# EAGLE schematic base (EAGLE 7.6.0)
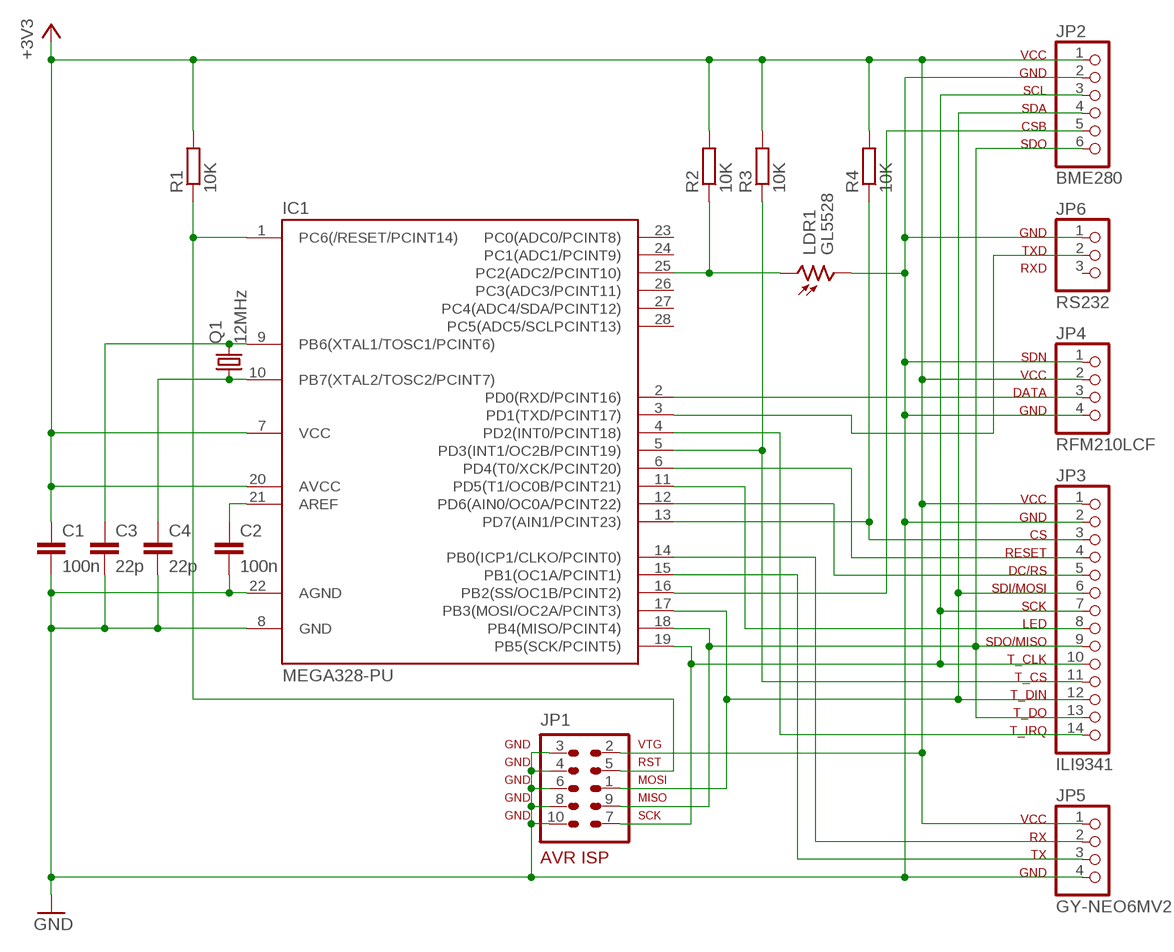
[diagram p0: schematic, sheet 1]

## Parts
C1  100n  C-EU025-025X050  [C025-025X050]
C2  100n  C-EU025-025X050  [C025-025X050]
C3  22p  C-EU025-025X050  [C025-025X050]
C4  22p  C-EU025-025X050  [C025-025X050]
IC1  MEGA328-PU  MEGA48/88/168-PU  [DIL28-3]
JP1  AVR-ISP-10  [AVR-ISP-10]
JP2  BME280  PINHD-1X6  [1X06]
JP3  ILI9341  PINHD-1X14  [1X14]
JP4  RFM210LCF  PINHD-1X4  [1X04]
JP5  GY-NEO6MV2  PINHD-1X4  [1X04]
JP6  RS232  PINHD-1X3  [1X03]
LDR1  GL5528  VT20N1  [TO46-VT200]
Q1  12MHz  CRYSTALHC49U-V  [HC49U-V]
R1  10K  R-EU_0204/7  [0204/7]
R2  10K  R-EU_0204/7  [0204/7]
R3  10K  R-EU_0204/7  [0204/7]
R4  10K  R-EU_0204/7  [0204/7]

## Nets
+3V3: C1.1 IC1.7(VCC) IC1.20(AVCC) JP1.2 JP2.1 JP3.1 JP4.2 JP5.1 R1.2 R2.2 R3.2 R4.2
GND: C1.2 C2.2 C3.2 C4.2 IC1.8(GND) IC1.22(AGND) JP1.3 JP1.4 JP1.6 JP1.8 JP1.10 JP2.2 JP3.2 JP4.1 JP4.4 JP5.4 JP6.1 LDR1.2
N$1: IC1.16(PB2(SS/OC1B/PCINT2)) JP2.5
N$2: IC1.1(PC6(/RESET/PCINT14)) JP1.5 R1.1
N$3: IC1.18(PB4(MISO/PCINT4)) JP1.9 JP2.6 JP3.9 JP3.13
N$4: C2.1 IC1.21(AREF)
N$5: IC1.2(PD0(RXD/PCINT16)) JP4.3
N$6: IC1.12(PD6(AIN0/OC0A/PCINT22)) JP3.5
N$7: IC1.13(PD7(AIN1/PCINT23)) JP3.3 R4.1
N$8: IC1.17(PB3(MOSI/OC2A/PCINT3)) JP1.1 JP2.4 JP3.6 JP3.12
N$9: IC1.4(PD2(INT0/PCINT18)) JP3.14
N$10: IC1.6(PD4(T0/XCK/PCINT20)) JP3.4
N$11: IC1.11(PD5(T1/OC0B/PCINT21)) JP3.8
N$12: IC1.19(PB5(SCK/PCINT5)) JP1.7 JP2.3 JP3.7 JP3.10
N$13: IC1.25(PC2(ADC2/PCINT10)) LDR1.1 R2.1
N$14: IC1.14(PB0(ICP1/CLKO/PCINT0)) JP5.2
N$15: IC1.15(PB1(OC1A/PCINT1)) JP5.3
N$16: IC1.5(PD3(INT1/OC2B/PCINT19)) JP3.11 R3.1
N$17: IC1.3(PD1(TXD/PCINT17)) JP6.2
N$18: C4.1 IC1.10(PB7(XTAL2/TOSC2/PCINT7)) Q1.1
N$19: C3.1 IC1.9(PB6(XTAL1/TOSC1/PCINT6)) Q1.2
Unconnected: IC1.23(PC0(ADC0/PCINT8)) IC1.24(PC1(ADC1/PCINT9)) IC1.26(PC3(ADC3/PCINT11)) IC1.27(PC4(ADC4/SDA/PCINT12)) IC1.28(PC5(ADC5/SCLPCINT13)) JP6.3

## Notes on the sheet
- VCC
  GND
  SCL
  SDA
  CSB
  SDO
- GND
  TXD
  RXD
- SDN
  VCC
  DATA
  GND
- VCC
  GND
  CS
  RESET
  DC/RS
  SDI/MOSI
  SCK
  LED
  SDO/MISO
  T_CLK
  T_CS
  T_DIN
  T_DO
  T_IRQ
- VCC
  RX
  TX
  GND

## Library data of the parts
C1-C4 = rcl:C-EU: CAPACITOR, European symbol
IC1 = avr-7:MEGA48/88/168-PU
JP1 = avr-7:AVR-ISP-10: AVR ISP-10 Serial Programming Header
JP2 = pinhead:PINHD-1X6: PIN HEADER
JP3 = pinhead:PINHD-1X14: PIN HEADER
JP4 JP5 = pinhead:PINHD-1X4: PIN HEADER
JP6 = pinhead:PINHD-1X3: PIN HEADER
LDR1 = photo-elements:VT2*: Photoconductive Cell VT200 Series Source: http://optoelectronics.perkinelmer.com/content/Datasheets/DTS_vt200seriesdatasheet.pdf
Q1 = crystal:CRYSTAL: CRYSTAL; OC_FARNELL: 1666969; OC_NEWARK: unknown
R1-R4 = rcl:R-EU_: RESISTOR, European symbol